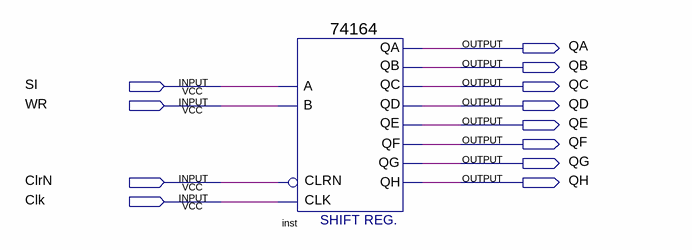
[diagram p0: schematic sheet]
// Quartus schematic SIPO_Register.bdf as structural Verilog: 1 symbols, 12 pins
module SIPO_Register (
  input  SI,
  input  WR,
  input  ClrN,
  input  Clk,
  output QA,
  output QB,
  output QC,
  output QD,
  output QE,
  output QF,
  output QG,
  output QH
);

  \74164  inst (
    .CLRN(ClrN), .CLK(Clk), .B(WR), .A(SI), .QD(QD), .QC(QC), .QA(QA), .QF(QF), .QH(QH), .QG(QG), .QE(QE),
    .QB(QB));
endmodule
